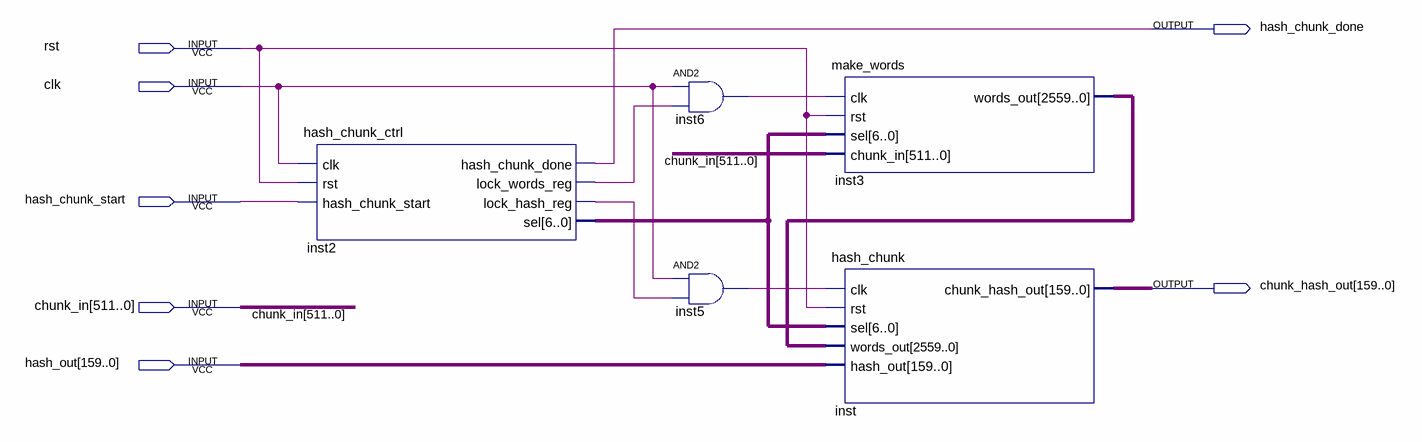
[diagram p0: schematic sheet]
// Quartus schematic hw_sha1.bdf as structural Verilog: 5 symbols, 7 pins
module hw_sha1 (
  input  rst,
  input  clk,
  input  hash_chunk_start,
  input  [511:0] chunk_in,
  input  [159:0] hash_out,
  output hash_chunk_done,
  output [159:0] chunk_hash_out
);

  wire inst2_lock_hash_reg, inst2_lock_words_reg, inst5_out, inst6_out;
  wire [6:0] inst2_sel;
  wire [2559:0] inst3_words_out;

  hash_chunk_ctrl inst2 (
    .clk(clk), .rst(rst), .hash_chunk_start(hash_chunk_start), .hash_chunk_done(hash_chunk_done),
    .lock_words_reg(inst2_lock_words_reg), .lock_hash_reg(inst2_lock_hash_reg), .sel(inst2_sel));
  and inst6 (inst6_out, clk, inst2_lock_words_reg);
  and inst5 (inst5_out, clk, inst2_lock_hash_reg);
  make_words inst3 (.clk(inst6_out), .rst(rst), .sel(inst2_sel), .chunk_in(chunk_in), .words_out(inst3_words_out));
  hash_chunk inst (
    .clk(inst5_out), .rst(rst), .sel(inst2_sel), .words_out(inst3_words_out), .hash_out(hash_out),
    .chunk_hash_out(chunk_hash_out));
endmodule
